# EAGLE design ANSI Mono vid board (EAGLE 6.5.0)
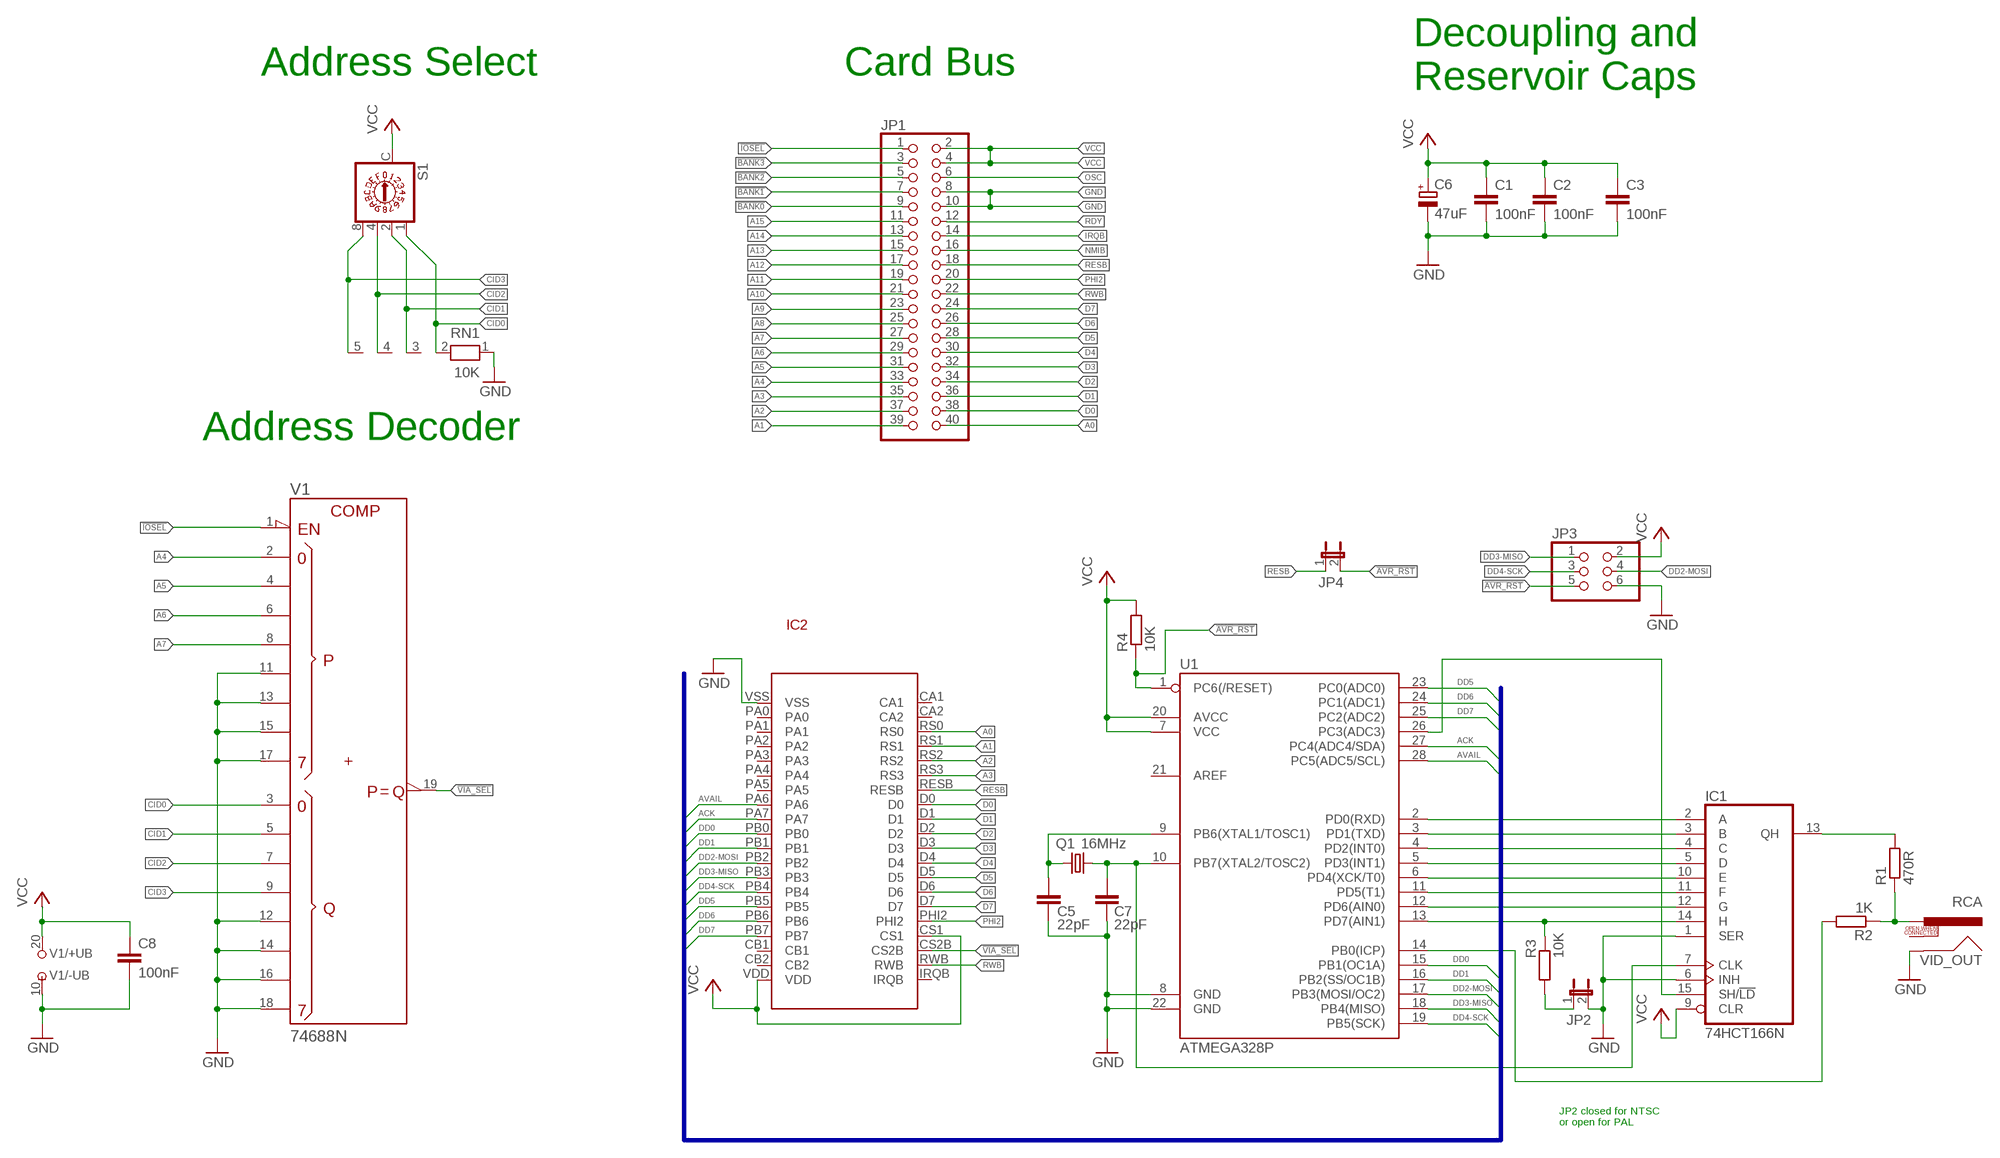
[diagram p0: schematic, sheet 1]

## Parts
C1  100nF  C-EU050-025X075  [C050-025X075]
C2  100nF  C-EU050-025X075  [C050-025X075]
C3  100nF  C-EU025-025X050  [C025-025X050]
C5  22pF  C-EU050-025X075  [C050-025X075]
C6  47uF  CPOL-EUE2.5-7  [E2,5-7]
C7  22pF  C-EU050-025X075  [C050-025X075]
C8  100nF  C-EU050-025X075  [C050-025X075]
IC1  74HCT166N  [DIL16]
IC2  W65C22  [W65C22-DIP]
JP1  PINHD-2X20/90  [2X20/90]
JP2  JP1E  [JP1]
JP3  PINHD-2X3  [2X03]
JP4  JP1E  [JP1]
Q1  16MHz  CRYSTALHC49U-V  [HC49U-V]
R1  470R  R-EU_0207/10  [0207/10]
R2  1K  R-EU_0207/10  [0207/10]
R3  10K  R-EU_0207/2V  [0207/2V]
R4  10K  R-EU_0207/7  [0207/7]
RN1  10K  RN04  [RN-5]
S1  DRR3016  [DRR3010]
U1  ATMEGA328P  ATMEGA328P_PDIP  [DIL28-3]
V1  74688N  [DIL20]
VID_OUT  RCA  [RCA]

## Nets
!AVR_RST: JP3.5 JP4.2 R4.1 U1.1(PC6(/RESET))
!BANK0: JP1.9
!BANK1: JP1.7
!BANK2: JP1.5
!BANK3: JP1.3
!IOSEL: JP1.1 V1.1(!G)
!VIA_SEL: IC2.CS2B V1.19(!P=Q)
A0: IC2.RS0 JP1.40
A1: IC2.RS1 JP1.39
A2: IC2.RS2 JP1.37
A3: IC2.RS3 JP1.35
A4: JP1.33 V1.2(P0)
A5: JP1.31 V1.4(P1)
A6: JP1.29 V1.6(P2)
A7: JP1.27 V1.8(P3)
A8: JP1.25
A9: JP1.23
A10: JP1.21
A11: JP1.19
A12: JP1.17
A13: JP1.15
A14: JP1.13
A15: JP1.11
ACK: IC2.PA7 U1.27(PC4(ADC4/SDA))
AVAIL: IC2.PA6 U1.28(PC5(ADC5/SCL))
CID0: RN1.2 S1.1 V1.3(Q0)
CID1: RN1.3 S1.2 V1.5(Q1)
CID2: RN1.4 S1.4 V1.7(Q2)
CID3: RN1.5 S1.8 V1.9(Q3)
D0: IC2.D0 JP1.38
D1: IC2.D1 JP1.36
D2: IC2.D2 JP1.34
D3: IC2.D3 JP1.32
D4: IC2.D4 JP1.30
D5: IC2.D5 JP1.28
D6: IC2.D6 JP1.26
D7: IC2.D7 JP1.24
DD0: IC2.PB0 U1.15(PB1(OC1A))
DD1: IC2.PB1 U1.16(PB2(SS/OC1B))
DD2-MOSI: IC2.PB2 JP3.4 U1.17(PB3(MOSI/OC2))
DD3-MISO: IC2.PB3 JP3.1 U1.18(PB4(MISO))
DD4-SCK: IC2.PB4 JP3.3 U1.19(PB5(SCK))
DD5: IC2.PB5 U1.23(PC0(ADC0))
DD6: IC2.PB6 U1.24(PC1(ADC1))
DD7: IC2.PB7 U1.25(PC2(ADC2))
GND: C1.2 C2.2 C3.2 C5.2 C6.- C7.2 C8.2 IC1.1(SER) IC1.6(INH) IC2.VSS JP1.8 JP1.10 JP2.2 JP3.6 RN1.1 U1.8(GND) U1.22(GND) V1.10(-UB) V1.11(P4) V1.12(Q4) V1.13(P5) V1.14(Q5) V1.15(P6) V1.16(Q6) V1.17(P7) V1.18(Q7) VID_OUT.SHELL
IRQB: JP1.14
N$1: JP2.1 R3.1
N$2: C5.1 Q1.2 U1.9(PB6(XTAL1/TOSC1))
N$3: C7.1 IC1.7(CLK) Q1.1 U1.10(PB7(XTAL2/TOSC2))
N$4: IC1.2(A) U1.2(PD0(RXD))
N$5: IC1.3(B) U1.3(PD1(TXD))
N$6: IC1.4(C) U1.4(PD2(INT0))
N$7: IC1.5(D) U1.5(PD3(INT1))
N$8: IC1.10(E) U1.6(PD4(XCK/T0))
N$9: IC1.11(F) U1.11(PD5(T1))
N$10: IC1.12(G) U1.12(PD6(AIN0))
N$11: IC1.14(H) R3.2 U1.13(PD7(AIN1))
N$12: IC1.13(QH) R1.2
N$13: R2.2 U1.14(PB0(ICP))
N$14: IC1.15(SH/!LD) U1.26(PC3(ADC3))
N$16: R1.1 R2.1 VID_OUT.PIN
NMIB: JP1.16
OSC: JP1.6
PHI2: IC2.PHI2 JP1.20
RDY: JP1.12
RESB: IC2.RESB JP1.18 JP4.1
RWB: IC2.RWB JP1.22
VCC: C1.1 C2.1 C3.1 C6.+ C8.1 IC1.9(CLR) IC2.CS1 IC2.VDD JP1.2 JP1.4 JP3.2 R4.2 S1.C U1.7(VCC) U1.20(AVCC) V1.20(+UB)
Unconnected: IC2.CA1 IC2.CA2 IC2.CB1 IC2.CB2 IC2.IRQB IC2.PA0 IC2.PA1 IC2.PA2 IC2.PA3 IC2.PA4 IC2.PA5 U1.21(AREF) VID_OUT.SWITCH

## Buses
DD[0..1],DD2-MOSI,DD3-MISO,DD4-SCK,DD[5..7],!AVR-RST,ACK,AVAIL

## Notes on the sheet
- Address Select | Card Bus
- Decoupling and
  Reservoir Caps
- Address Decoder
- JP2 closed for NTSC
  or open for PAL

## Power pins joined to a net without a drawn wire
GND: IC1.8(GND)
VCC: IC1.16(VCC)

## Library data of the parts
C1-C3 C5 C7 C8 = rcl:C-EU: CAPACITOR, European symbol
C6 = rcl:CPOL-EU: POLARIZED CAPACITOR, European symbol
IC1 = 74xx-eu:74*166: 8-bit parallel load SHIFT REGISTER
IC2 = W65XX Support:W65C22
JP1 = pinhead:PINHD-2X20: PIN HEADER
JP2 JP4 = jumper:JP1E: JUMPER
JP3 = pinhead:PINHD-2X3: PIN HEADER
Q1 = crystal:CRYSTAL: CRYSTAL; OC_FARNELL: 1666969; OC_NEWARK: unknown
R1-R4 = rcl:R-EU_: RESISTOR, European symbol
RN1 = resistor-net:RN04: RESISTOR NETWORK; OC_FARNELL: unknown; OC_NEWARK: unknown
S1 = switch-dil:DRR3016: DIL/CODE SWITCH; MPN: DRR3016; OC_FARNELL: 9810439; OC_NEWARK: 96K8699
U1 = SparkFun-DigitalIC:ATMEGA328P_PDIP: uC used in the Arduino 32kb flash, 1k EEPROM, 2k SRAM This is the through-hole version of this chip.
V1 = 74ttl-din:74*688: 8-bit MAGNITUDE/IDENTITY COMPARATOR, totem pole
VID_OUT = SparkFun-Connectors:RCA

## Board
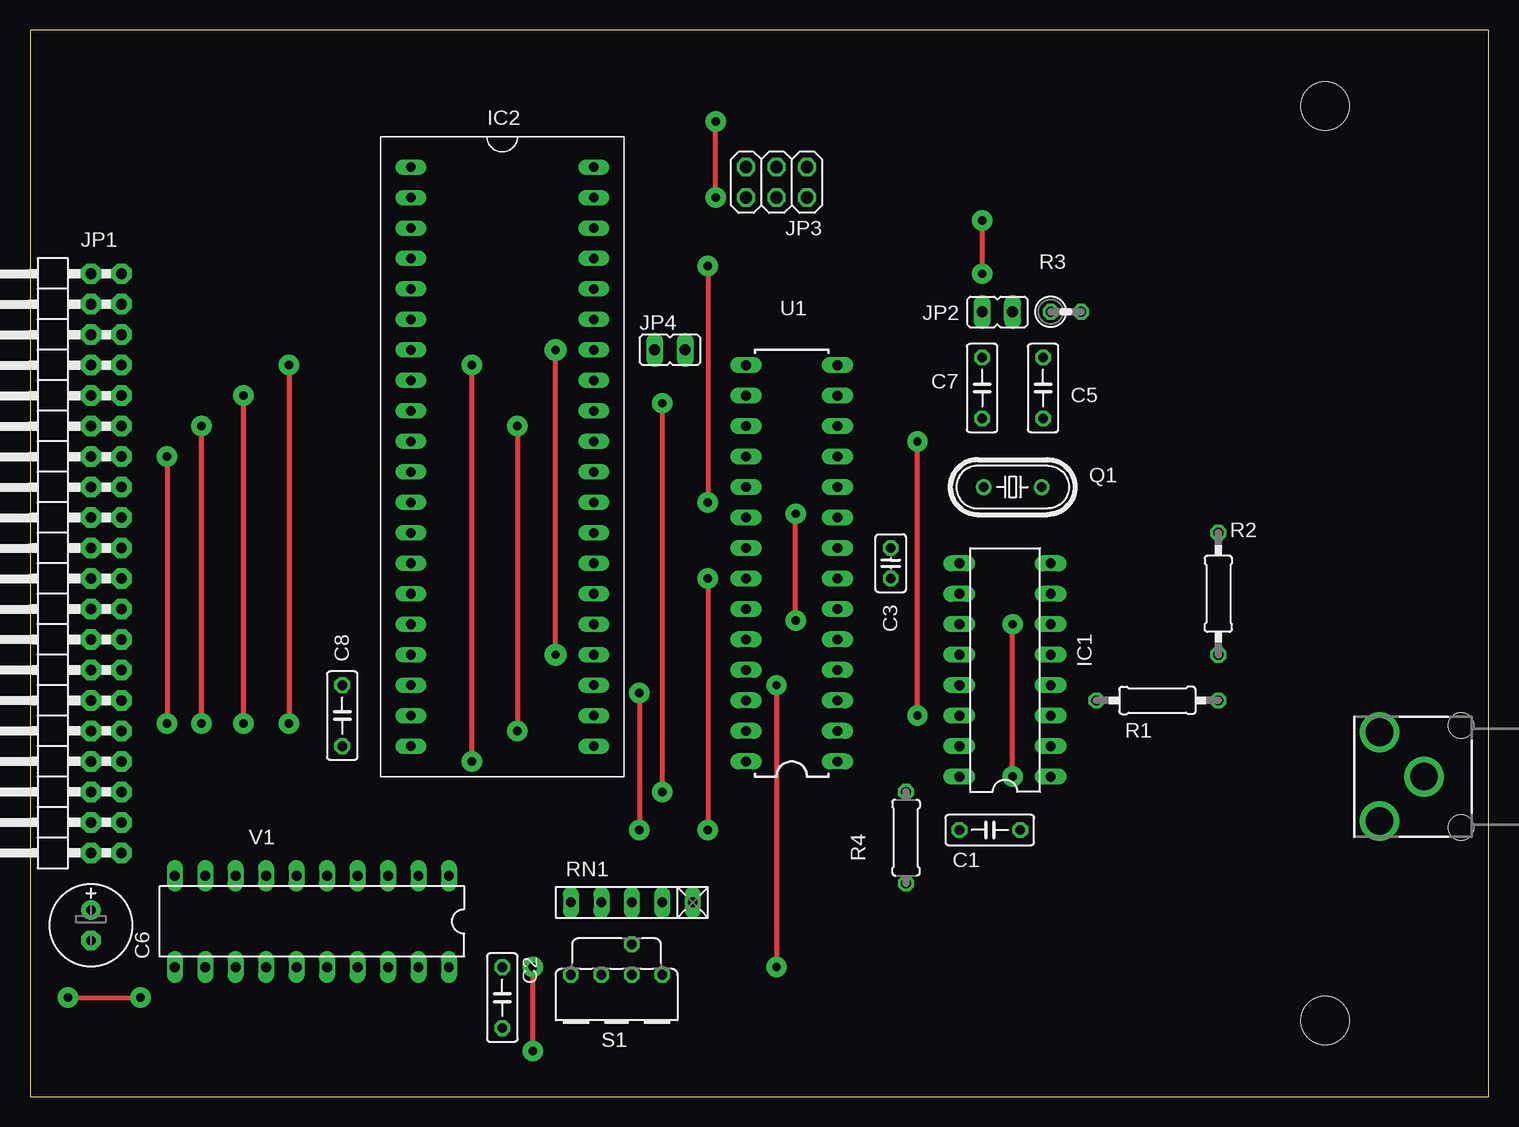
[diagram p1: board, top side]
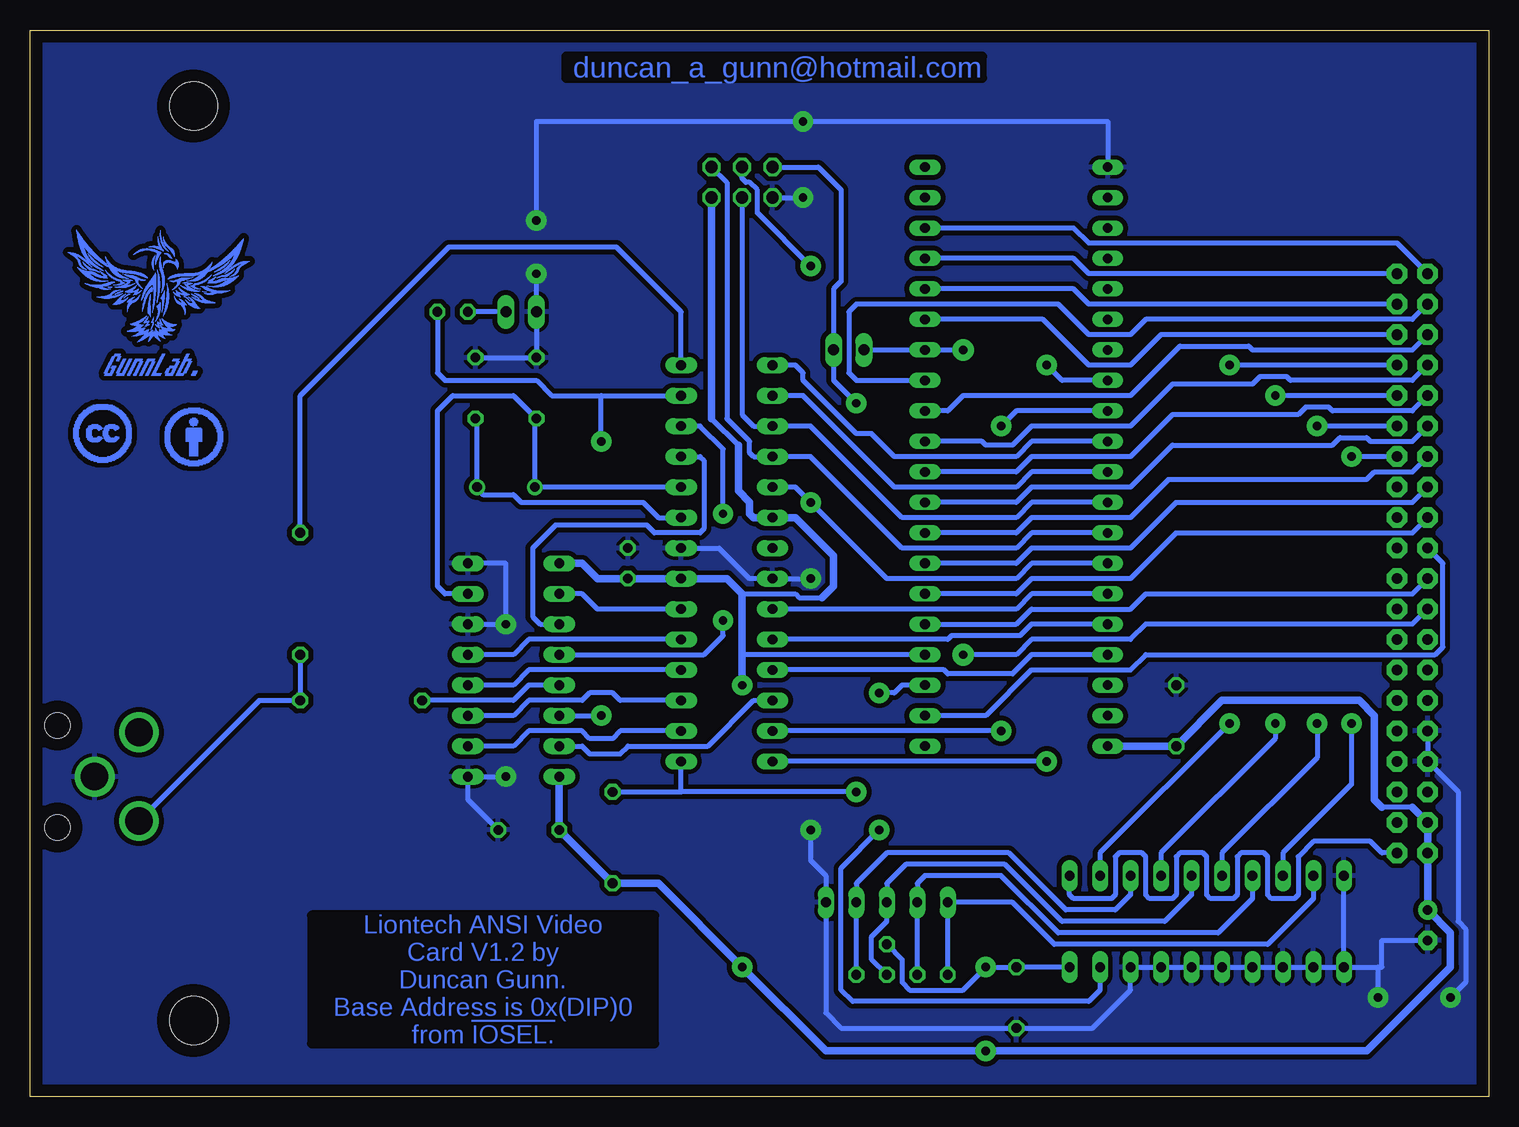
[diagram p2: board, bottom side, seen from below]

Size 121.59 x 88.89 mm. Coordinates in mm from the lower left corner, seen from the top.
Outline: 0,0 121.59,0 121.59,88.89 0,88.89 0,0
Copper layers (1*16): Top 0.035mm / dielectric 1.5mm / Bottom 0.035mm
Design rules "default *": minimum track width 10mil, minimum drill 24mil, track to track 8mil, track to pad 8mil, pad to pad 8mil, via to via 8mil, smd to smd 8mil, copper to edge 40mil, drill to drill 8mil, minimum pad ring 10mil, minimum via ring 8mil, stop-mask expansion 4mil, vias tented up to drill 0mil, thermal gap 12mil
Holes 4 mm at 107.95,82.55 107.95,6.35

### Footprints (pad centres in the part's own frame; a part is rotated, then mirrored left to right if it is on the bottom)
C050-025X075 = drill 0.813 octagon: 1 -2.54,0; 2 2.54,0
C025-025X050 = drill 0.813 octagon: 1 -1.27,0; 2 1.27,0
E2,5-7 = drill 0.813 pad 1.6: + -1.27,0 | drill 0.813 pad 1.6 octagon: - 1.27,0
DIL16 = drill 0.813 long: 1 -8.89,-3.81; 2 -6.35,-3.81; 3 -3.81,-3.81; 4 -1.27,-3.81; 5 1.27,-3.81; 6 3.81,-3.81; 7 6.35,-3.81; 8 8.89,-3.81; 9 8.89,3.81; 10 6.35,3.81; 11 3.81,3.81; 12 1.27,3.81; 13 -1.27,3.81; 14 -3.81,3.81; 15 -6.35,3.81; 16 -8.89,3.81
W65C22-DIP = drill 0.8 long: CA1 7.62,24.13; CA2 7.62,21.59; CB1 -7.62,-19.05; CB2 -7.62,-21.59; CS1 7.62,-16.51; CS2B 7.62,-19.05; D0 7.62,6.35; D1 7.62,3.81; D2 7.62,1.27; D3 7.62,-1.27; D4 7.62,-3.81; D5 7.62,-6.35; D6 7.62,-8.89; D7 7.62,-11.43; IRQB 7.62,-24.13; PA0 -7.62,21.59; PA1 -7.62,19.05; PA2 -7.62,16.51; PA3 -7.62,13.97; PA4 -7.62,11.43; PA5 -7.62,8.89; PA6 -7.62,6.35; PA7 -7.62,3.81; PB0 -7.62,1.27; PB1 -7.62,-1.27; PB2 -7.62,-3.81; PB3 -7.62,-6.35; PB4 -7.62,-8.89; PB5 -7.62,-11.43; PB6 -7.62,-13.97; PB7 -7.62,-16.51; PHI2 7.62,-13.97; RESB 7.62,8.89; RS0 7.62,19.05; RS1 7.62,16.51; RS2 7.62,13.97; RS3 7.62,11.43; RWB 7.62,-21.59; VDD -7.62,-24.13; VSS -7.62,24.13
2X20/90 = drill 0.889 pad 1.702 octagon: 1 -24.13,-6.35; 2 -24.13,-3.81; 3 -21.59,-6.35; 4 -21.59,-3.81; 5 -19.05,-6.35; 6 -19.05,-3.81; 7 -16.51,-6.35; 8 -16.51,-3.81; 9 -13.97,-6.35; 10 -13.97,-3.81; 11 -11.43,-6.35; 12 -11.43,-3.81; 13 -8.89,-6.35; 14 -8.89,-3.81; 15 -6.35,-6.35; 16 -6.35,-3.81; 17 -3.81,-6.35; 18 -3.81,-3.81; 19 -1.27,-6.35; 20 -1.27,-3.81; 21 1.27,-6.35; 22 1.27,-3.81; 23 3.81,-6.35; 24 3.81,-3.81; 25 6.35,-6.35; 26 6.35,-3.81; 27 8.89,-6.35; 28 8.89,-3.81; 29 11.43,-6.35; 30 11.43,-3.81; 31 13.97,-6.35; 32 13.97,-3.81; 33 16.51,-6.35; 34 16.51,-3.81; 35 19.05,-6.35; 36 19.05,-3.81; 37 21.59,-6.35; 38 21.59,-3.81; 39 24.13,-6.35; 40 24.13,-3.81
JP1 = drill 0.914 long: 1 0,-1.27; 2 0,1.27
2X03 = drill 1.016 octagon: 1 -2.54,-1.27; 2 -2.54,1.27; 3 0,-1.27; 4 0,1.27; 5 2.54,-1.27; 6 2.54,1.27
HC49U-V = drill 0.813: 1 -2.413,0; 2 2.413,0
0207/10 = drill 0.813 octagon: 1 -5.08,0; 2 5.08,0
0207/2V = drill 0.813 octagon: 1 -1.27,0; 2 1.27,0
0207/7 = drill 0.813 octagon: 1 -3.81,0; 2 3.81,0
RN-5 = drill 0.813 long: 1 -5.08,0; 2 -2.54,0; 3 0,0; 4 2.54,0; 5 5.08,0
DRR3010 = drill 0.813 octagon: 1 3.81,0; 2 1.27,0; 4 -1.27,0; 8 -3.81,0; C 1.27,2.54
DIL28-3 = drill 0.813 long: 1 -16.51,-3.81; 2 -13.97,-3.81; 3 -11.43,-3.81; 4 -8.89,-3.81; 5 -6.35,-3.81; 6 -3.81,-3.81; 7 -1.27,-3.81; 8 1.27,-3.81; 9 3.81,-3.81; 10 6.35,-3.81; 11 8.89,-3.81; 12 11.43,-3.81; 13 13.97,-3.81; 14 16.51,-3.81; 15 16.51,3.81; 16 13.97,3.81; 17 11.43,3.81; 18 8.89,3.81; 19 6.35,3.81; 20 3.81,3.81; 21 1.27,3.81; 22 -1.27,3.81; 23 -3.81,3.81; 24 -6.35,3.81; 25 -8.89,3.81; 26 -11.43,3.81; 27 -13.97,3.81; 28 -16.51,3.81
DIL20 = drill 0.813 long: 1 -11.43,-3.81; 2 -8.89,-3.81; 3 -6.35,-3.81; 4 -3.81,-3.81; 5 -1.27,-3.81; 6 1.27,-3.81; 7 3.81,-3.81; 8 6.35,-3.81; 9 8.89,-3.81; 10 11.43,-3.81; 11 11.43,3.81; 12 8.89,3.81; 13 6.35,3.81; 14 3.81,3.81; 15 1.27,3.81; 16 -1.27,3.81; 17 -3.81,3.81; 18 -6.35,3.81; 19 -8.89,3.81; 20 -11.43,3.81
RCA = drill 2.3: PIN 3.7,3.7; SHELL 0,0; SWITCH 3.7,-3.7 | hole 2.1: -3.1,4.25; -3.1,-4.25

### Placement (x,y rotation side)
C1  80.01,22.23 0 top
C2  39.37,8.26 270 top
C3  71.75,44.45 90 top
C5  84.45,59.05 90 top
C6  5.08,14.29 270 top
C7  79.38,59.05 90 top
C8  26.04,31.75 90 top
IC1  81.28,35.56 90 top
IC2  39.37,53.34 0 top
JP1  1.27,44.45 90 top
JP2  80.64,65.41 90 top
JP3  62.23,76.2 180 top
JP4  53.34,62.23 270 top
Q1  81.92,50.8 0 top
R1  93.98,33.02 180 top
R2  99.06,41.91 90 top
R3  86.36,65.41 0 top
R4  73.03,21.59 270 top
RN1  50.16,16.19 180 top
S1  48.9,10.16 0 top
U1  63.5,44.45 90 top
U$1  [LIONTECH]  111.12,66.67 0 top
U$2  [CC]  115.57,55.24 180 top
U$3  [BY]  107.95,54.93 0 top
V1  23.5,14.61 180 top
VID_OUT  116.2,26.67 180 top

### Tracks (layer width: path | path; a pad name or v marks a point on that pad's centre or on a via)
!AVR_RST  (via drill 0.7 pad 1.7)
  Top 0.406: v52.7,57.78 v52.7,25.4
  Bottom 0.406: JP3.5 55.88,77.47 53.98,75.56 53.98,67.94 54.61,67.31 JP4.2 54.61,59.69 v52.7,57.78 | v52.7,25.4 67.31,25.4 | 67.31,25.4 U1.1 | R4.1 67.31,25.4
!IOSEL
  Bottom 0.406: JP1.1 8.89,20.32 9.84,21.27 14.61,21.27 15.88,20 15.88,16.83 16.19,16.51 18.1,16.51 18.41,16.83 18.41,20 18.73,20.32 20.64,20.32 20.95,20 20.95,16.83 21.27,16.51 23.18,16.51 23.5,16.83 23.5,20 23.81,20.32 25.72,20.32 26.04,20 26.04,16.83 26.35,16.51 28.26,16.51 28.57,16.83 28.57,20 28.89,20.32 30.8,20.32 31.11,20 31.11,16.83 31.43,16.51 34.61,16.51 34.92,16.83 V1.1
!VIA_SEL  (via drill 0.7 pad 1.7)
  Top 0.406: v50.8,33.66 v50.8,22.23
  Bottom 0.406: IC2.CS2B 48.9,34.29 49.53,33.66 v50.8,33.66 | v50.8,22.23 53.98,19.05 53.98,8.89 53.02,7.94 33.34,7.94 32.38,8.89 V1.19
A0
  Bottom 0.406: JP1.40 7.62,71.12 33.34,71.12 34.61,72.39 IC2.RS0
A1
  Bottom 0.406: JP1.39 33.34,68.58 34.61,69.85 IC2.RS1
A2
  Bottom 0.406: JP1.37 33.34,66.04 34.61,67.31 IC2.RS2
A3
  Bottom 0.406: JP1.35 27.3,63.5 29.84,60.96 33.34,60.96 37.15,64.77 IC2.RS3
A4  (via drill 0.7 pad 1.7)
  Top 0.406: v21.59,60.96 v21.59,31.11
  Bottom 0.406: JP1.33 v21.59,60.96 | V1.2 32.38,20.32 v21.59,31.11
A5  (via drill 0.7 pad 1.7)
  Top 0.406: v17.78,58.42 v17.78,31.11
  Bottom 0.406: JP1.31 v17.78,58.42 | V1.4 27.3,20.32 17.78,29.84 v17.78,31.11
A6  (via drill 0.7 pad 1.7)
  Top 0.406: v14.29,55.88 v14.29,31.11
  Bottom 0.406: JP1.29 v14.29,55.88 | V1.6 22.23,20.32 14.29,28.26 v14.29,31.11
A7  (via drill 0.7 pad 1.7)
  Top 0.406: v11.43,53.34 v11.43,31.11
  Bottom 0.406: JP1.27 v11.43,53.34 | V1.8 17.14,20.32 11.43,26.04 v11.43,31.11
ACK  (via drill 0.7 pad 1.7)
  Top 0.406: v40.64,55.88 v40.64,30.48
  Bottom 0.406: IC2.PA7 39.37,57.15 v40.64,55.88 | v40.64,30.48 U1.27
AVAIL  (via drill 0.7 pad 1.7)
  Top 0.406: v36.83,60.96 v36.83,27.94
  Bottom 0.406: IC2.PA6 35.56,59.69 v36.83,60.96 | v36.83,27.94 U1.28
CID0
  Bottom 0.406: V1.3 29.84,16.83 31.11,15.56 35.24,15.56 40.01,20.32 50.16,20.32 52.7,17.78 RN1.2 S1.1
CID1
  Bottom 0.406: V1.5 24.77,16.83 26.99,14.61 35.56,14.61 40.32,19.37 48.58,19.37 50.16,17.78 RN1.3 50.16,14.61 51.44,13.34 51.44,11.43 S1.2
CID2
  Bottom 0.406: V1.7 19.68,16.51 22.54,13.65 35.88,13.65 40.64,18.41 46.99,18.41 47.62,17.78 RN1.4 S1.4
CID3
  Bottom 0.406: V1.9 14.61,16.51 18.41,12.7 36.2,12.7 39.69,16.19 RN1.5 S1.8
D0
  Bottom 0.406: JP1.38 6.35,64.77 28.57,64.77 29.84,63.5 33.34,63.5 35.88,66.04 52.7,66.04 53.34,65.41 53.34,60.33 52.7,59.69 IC2.D0
D1
  Bottom 0.406: JP1.36 6.35,62.23 19.68,62.23 20,62.55 25.72,62.55 29.84,58.42 43.81,58.42 45.09,57.15 IC2.D1
D2
  Bottom 0.406: JP1.34 6.35,59.69 16.51,59.69 16.83,60.01 19.05,60.01 19.68,59.37 26.35,59.37 29.84,55.88 38.1,55.88 39.69,54.29 41.91,54.29 42.23,54.61 IC2.D2
D3
  Bottom 0.406: JP1.32 6.35,57.15 13.02,57.15 13.34,57.47 15.24,57.47 15.88,56.83 26.35,56.83 29.84,53.34 38.1,53.34 39.37,52.07 IC2.D3
D4
  Bottom 0.406: JP1.30 6.35,54.61 9.84,54.61 10.16,54.93 12.38,54.93 13.02,54.29 26.35,54.29 29.84,50.8 38.1,50.8 39.37,49.53 IC2.D4
D5
  Bottom 0.406: JP1.28 6.35,52.07 9.53,52.07 10.16,51.44 26.67,51.44 29.84,48.26 38.1,48.26 39.37,46.99 IC2.D5
D6
  Bottom 0.406: JP1.26 6.35,49.53 26.04,49.53 29.84,45.72 38.1,45.72 39.37,44.45 IC2.D6
D7
  Bottom 0.406: JP1.24 6.35,46.99 26.04,46.99 29.84,43.18 38.1,43.18 39.37,41.91 IC2.D7
DD0
  Bottom 0.406: IC2.PB0 38.1,54.61 39.37,53.34 49.53,53.34 51.44,55.24 52.7,55.24 57.15,59.69 57.15,60.33 57.78,60.96 U1.15
DD1
  Bottom 0.406: IC2.PB1 38.1,52.07 39.37,50.8 49.53,50.8 57.15,58.42 U1.16
DD2-MOSI
  Bottom 0.406: IC2.PB2 38.1,49.53 39.37,48.26 48.9,48.26 56.52,55.88 U1.17 61.28,55.88 62.23,56.83 JP3.4
DD3-MISO
  Bottom 0.406: IC2.PB3 38.1,46.99 39.37,45.72 48.9,45.72 56.52,53.34 U1.18 61.28,53.34 61.59,53.66 61.59,54.61 63.5,56.52 63.5,76.2 JP3.1
DD4-SCK  (via drill 0.7 pad 1.7)
  Top 0.406: v56.52,69.22 v56.52,49.53
  Bottom 0.406: IC2.PB4 38.1,44.45 39.37,43.18 50.16,43.18 v56.52,49.53 57.78,50.8 U1.19 | v56.52,69.22 60.96,73.66 60.96,75.56 61.59,76.2 61.91,76.2 62.23,76.52 JP3.3
DD5
  Bottom 0.406: IC2.PB5 38.1,41.91 39.37,40.64 U1.23
DD6
  Bottom 0.406: IC2.PB6 38.1,39.37 39.05,38.42 44.77,38.42 45.09,38.1 U1.24
DD7
  Bottom 0.406: IC2.PB7 38.1,36.83 39.37,35.56 39.69,35.24 45.09,35.24 45.4,35.56 U1.25
GND  (via drill 0.7 pad 1.7)
  Top 0.406: v3.17,8.26 v9.21,8.26 | v79.38,68.58 v79.38,73.03 | v57.15,74.93 v57.15,81.28 | v81.92,26.67 v81.92,39.37 | v56.52,43.18 v56.52,22.23
  Bottom 0.406: C5.2 C7.2 JP2.2 v79.38,68.58 | U1.8 64.14,45.72 61.59,43.18 U1.22 v56.52,43.18 | V1.11 V1.12 V1.13 V1.14 V1.15 V1.16 V1.17 V1.18 29.84,8.89 33.02,5.71 C2.2 53.98,5.71 55.24,6.99 RN1.1 55.24,18.41 56.52,19.68 v56.52,22.23 | V1.11 9.21,10.79 | 9.21,10.79 8.89,10.79 8.89,13.02 C6.- | V1.11 V1.10 | JP1.10 JP1.8 2.54,25.4 2.54,14.61 1.91,13.97 1.91,9.53 v3.17,8.26 | v9.21,8.26 9.21,10.79 | v79.38,73.03 79.38,81.28 v57.15,81.28 31.75,81.28 IC2.VSS | JP3.6 v57.15,74.93 | C1.2 85.09,24.77 IC1.1 v81.92,26.67 | IC1.6 v81.92,39.37 81.92,44.45 IC1.8
  pour Bottom (isolate 0.406): -0.64,88.9 121.92,88.9 121.92,0 -0.64,0
N$1
  Bottom 0.406: JP2.1 R3.1
N$2
  Bottom 0.406: C5.1 84.33,56.39 Q1.2 84.33,50.67 83.82,50.16 81.28,50.16 80.64,49.53 70.48,49.53 69.22,48.26 U1.9
N$3
  Bottom 0.406: U1.10 Q1.1 79.5,56.39 C7.1 81.28,58.42 86.36,58.42 87.63,57.15 87.63,42.55 87,41.91 IC1.7
N$4
  Bottom 0.406: U1.2 72.39,30.48 73.03,29.84 74.93,29.84 75.56,30.48 80.01,30.48 81.28,29.21 IC1.2
N$5
  Bottom 0.406: U1.3 72.39,33.02 73.03,33.66 74.93,33.66 75.56,33.02 80.01,33.02 81.28,31.75 IC1.3
N$6
  Bottom 0.406: U1.4 80.01,35.56 81.28,34.29 IC1.4
N$7
  Bottom 0.406: U1.5 80.01,38.1 81.28,36.83 IC1.5
N$8
  Bottom 0.406: U1.6 74.3,40.64 75.56,41.91 IC1.10
N$9
  Bottom 0.406: U1.11 65.72,53.34 65.41,53.02 65.41,47.31 65.72,46.99 69.53,46.99 70.17,47.62 77.79,47.62 79.69,45.72 79.69,40.01 79.06,39.37 IC1.11
N$10  (via drill 0.7 pad 1.7)
  Top 0.406: v63.82,39.69 v63.82,48.58
  Bottom 0.406: IC1.12 65.41,36.83 63.82,38.42 v63.82,39.69 | v63.82,48.58 63.82,53.98 65.72,55.88 U1.12
N$11  (via drill 0.7 pad 1.7)
  Top 0.406: v73.98,31.75 v73.98,54.61
  Bottom 0.406: R3.2 87.63,60.33 87,59.69 79.38,59.69 78.11,58.42 73.98,58.42 | 73.98,58.42 U1.13 | IC1.14 v73.98,31.75 | v73.98,54.61 73.98,58.42
N$12
  Bottom 0.406: IC1.13 80.01,34.29 81.28,33.02 R1.2
N$13
  Bottom 0.406: U1.14 67.31,65.41 72.71,70.8 86.68,70.8 99.06,58.42 R2.2
N$14
  Bottom 0.406: IC1.15 75.56,29.21 74.93,28.57 72.39,28.57 71.75,29.21 65.09,29.21 61.28,33.02 U1.26
N$16
  Bottom 0.406: VID_OUT.PIN 112.39,22.86 112.61,22.86 102.45,33.02 R1.1 R2.1
PHI2
  Bottom 0.406: IC2.PHI2 39.37,39.37 38.1,40.64 29.84,40.64 28.57,41.91 6.35,41.91 JP1.20
RESB  (via drill 0.7 pad 1.8)
  Top 0.406: v43.81,36.83 v43.81,62.23
  Bottom 0.406: v43.81,62.23 IC2.RESB JP4.1 | JP1.18 6.35,39.37 28.57,39.37 29.84,38.1 38.1,38.1 39.37,36.83 v43.81,36.83
RWB
  Bottom 0.406: JP1.22 3.81,44.45 3.81,37.47 4.45,36.83 28.57,36.83 29.84,35.56 38.1,35.56 41.91,31.75 IC2.RWB
VCC  (via drill 0.7 pad 1.7)
  Top 0.406: v62.23,34.29 v62.23,10.79 | v41.91,10.79 v41.91,3.81
  Bottom 0.406: 72.39,43.18 C3.1 | 62.23,41.91 57.78,41.91 57.47,41.59 55.56,41.59 | 64.77,56.52 62.55,54.29 | S1.C 48.9,11.43 48.9,9.53 48.26,8.89 43.81,8.89 v41.91,10.79 C2.1 V1.20 | IC2.CS1 62.23,36.83 | 6.35,24.13 8.89,24.13
  Bottom 0.61: IC1.9 75.56,44.45 74.3,43.18 72.39,43.18 | C3.1 U1.7 63.5,43.18 62.23,41.91 62.23,36.83 v62.23,34.29 | JP3.2 64.77,56.52 | 62.55,54.29 62.55,50.48 61.59,49.53 61.59,48.58 61.28,48.26 U1.20 57.78,48.26 54.61,45.09 54.61,42.55 55.56,41.59 | IC1.16 C1.1 R4.2 69.22,17.78 v62.23,10.79 55.24,3.81 v41.91,3.81 10.16,3.81 3.17,10.79 3.17,13.65 C6.+ JP1.2 JP1.4 6.35,24.13 | 8.89,24.13 9.53,24.77 9.53,31.75 10.79,33.02 22.23,33.02 C8.1 IC2.VDD

### Text on the board
Bottom: duncan_a_gunn@hotmail.com | Liontech ANSI Video / Card V1.2 by / Duncan Gunn. / Base Address is 0x(DIP)0 / from !IOSEL.